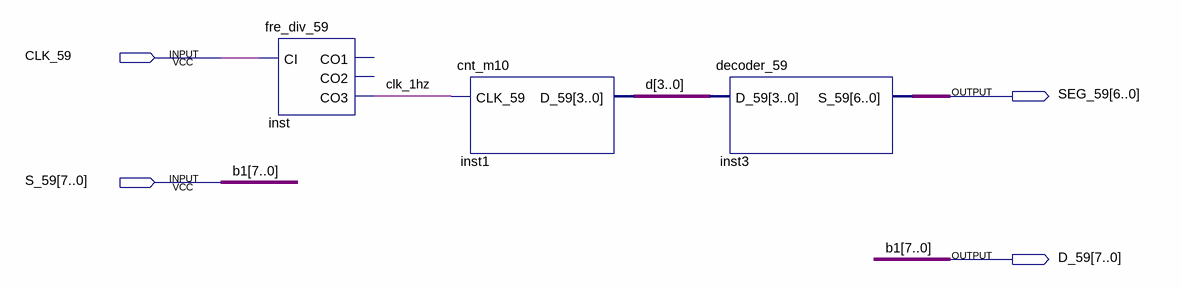
[diagram p0: schematic sheet]
// Quartus schematic static_display_59.bdf as structural Verilog: 3 symbols, 4 pins
module static_display_59 (
  input  CLK_59,
  input  [7:0] S_59,
  output [6:0] SEG_59,
  output [7:0] D_59
);

  wire clk_1hz;
  wire [3:0] d;

  fre_div_59 inst (.CI(CLK_59), .CO3(clk_1hz));  // open: CO1, CO2
  cnt_m10 inst1 (.CLK_59(clk_1hz), .D_59(d));
  decoder_59 inst3 (.D_59(d), .S_59(SEG_59));

  assign D_59 = S_59;

  // Other names for the same wires on the sheet: b1[7:0] = S_59
endmodule
